# EAGLE design Solenoid Board (EAGLE 9.2.0)
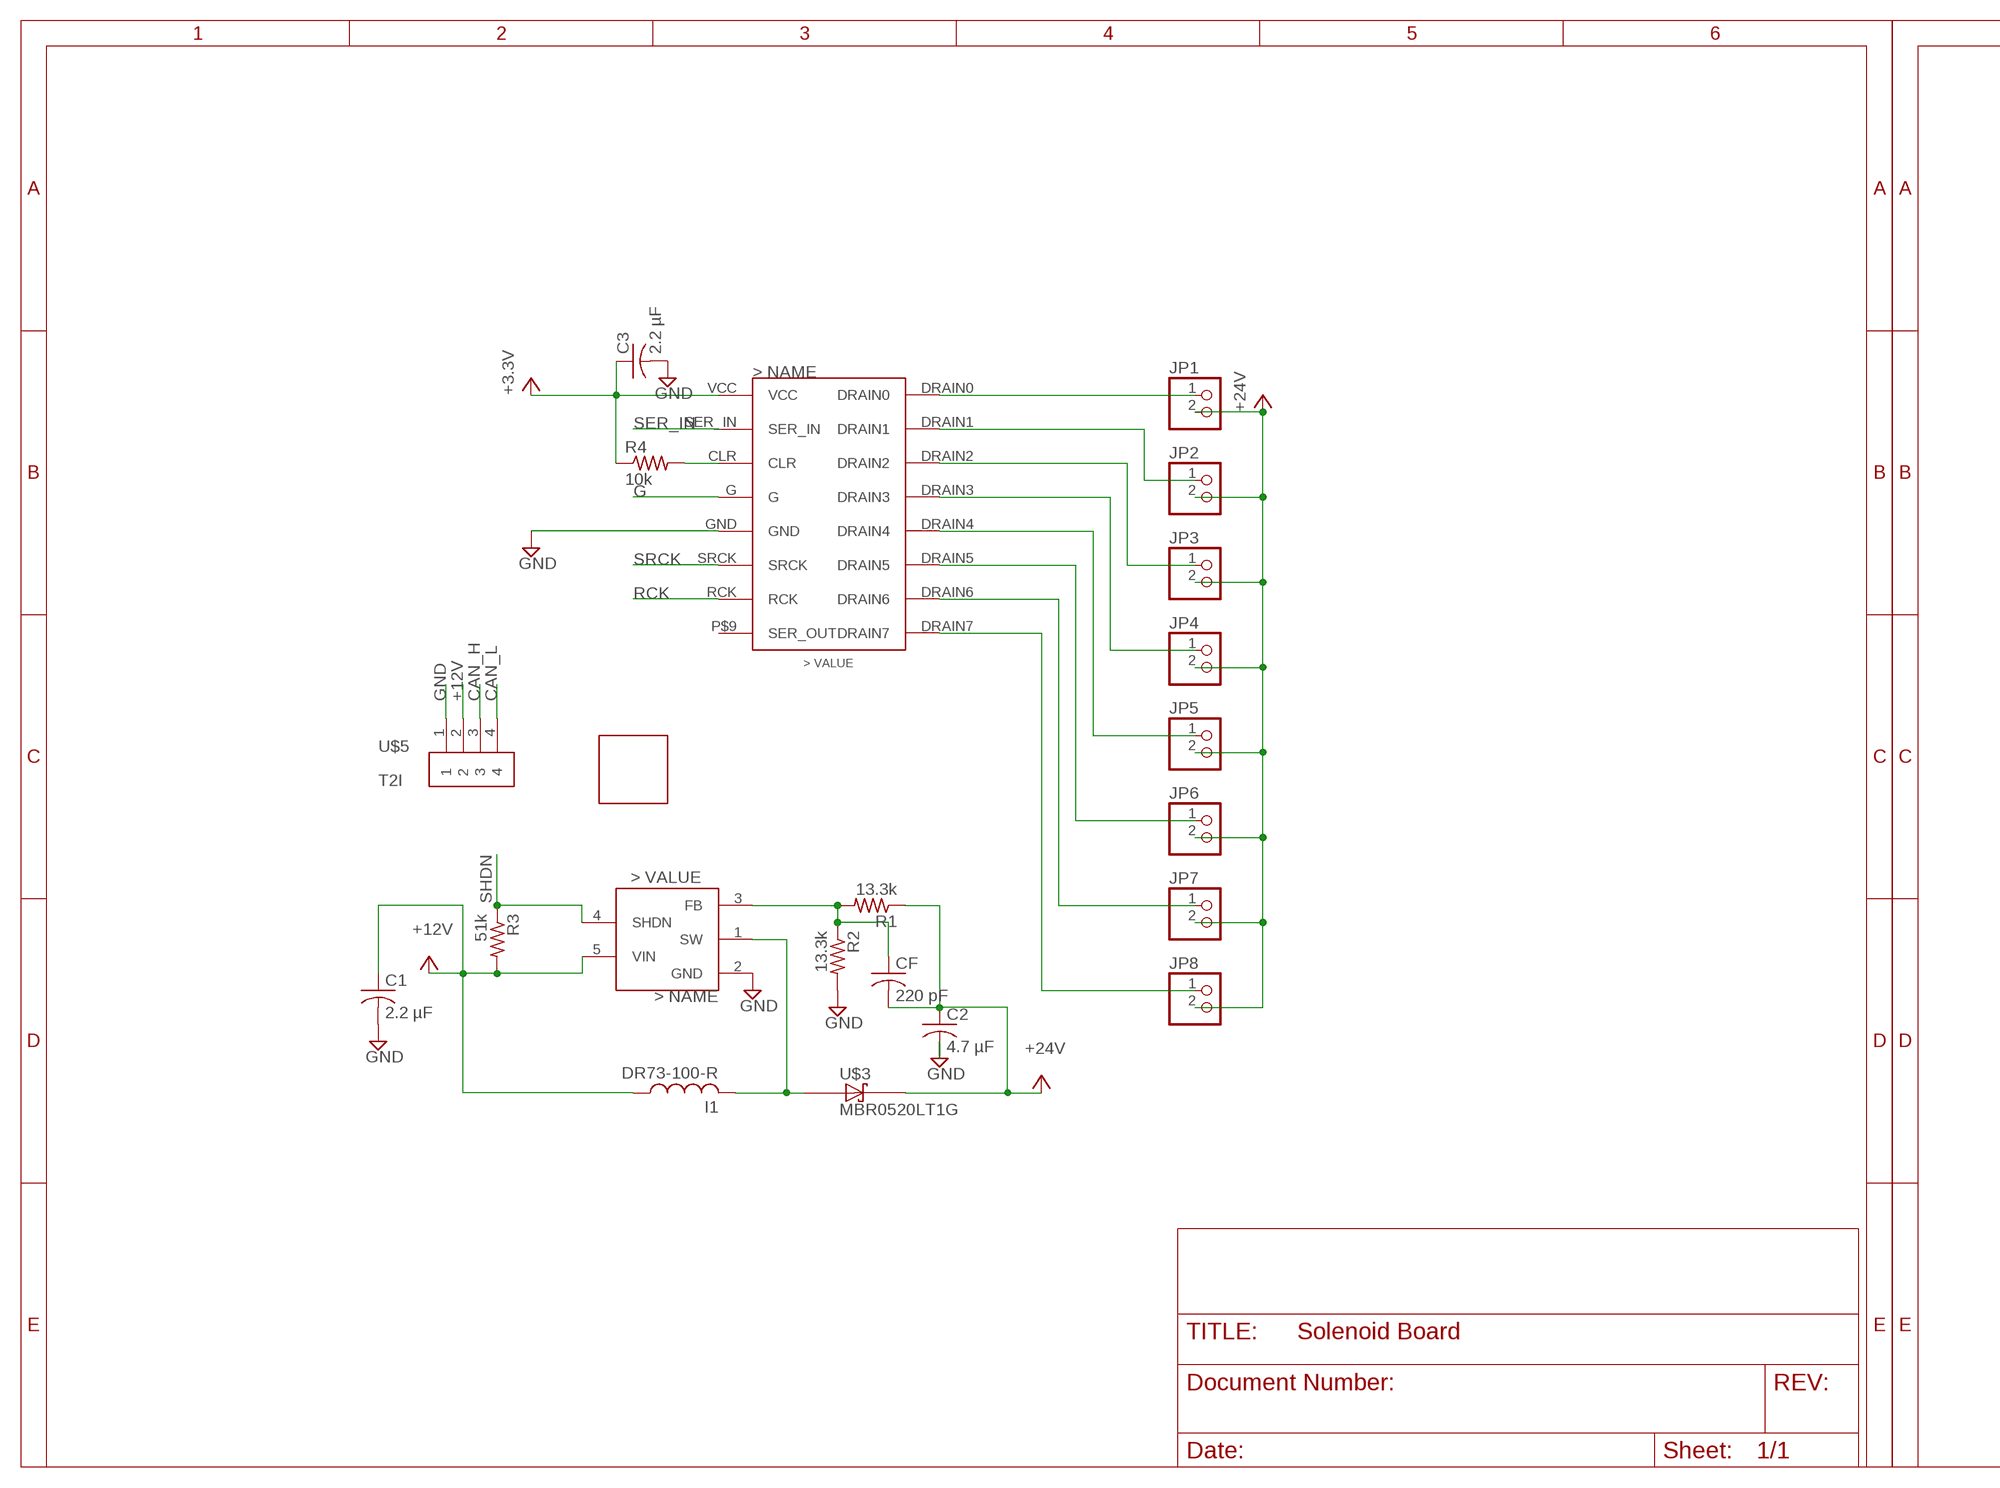
[diagram p0: schematic, sheet 1, part 1 of 2]
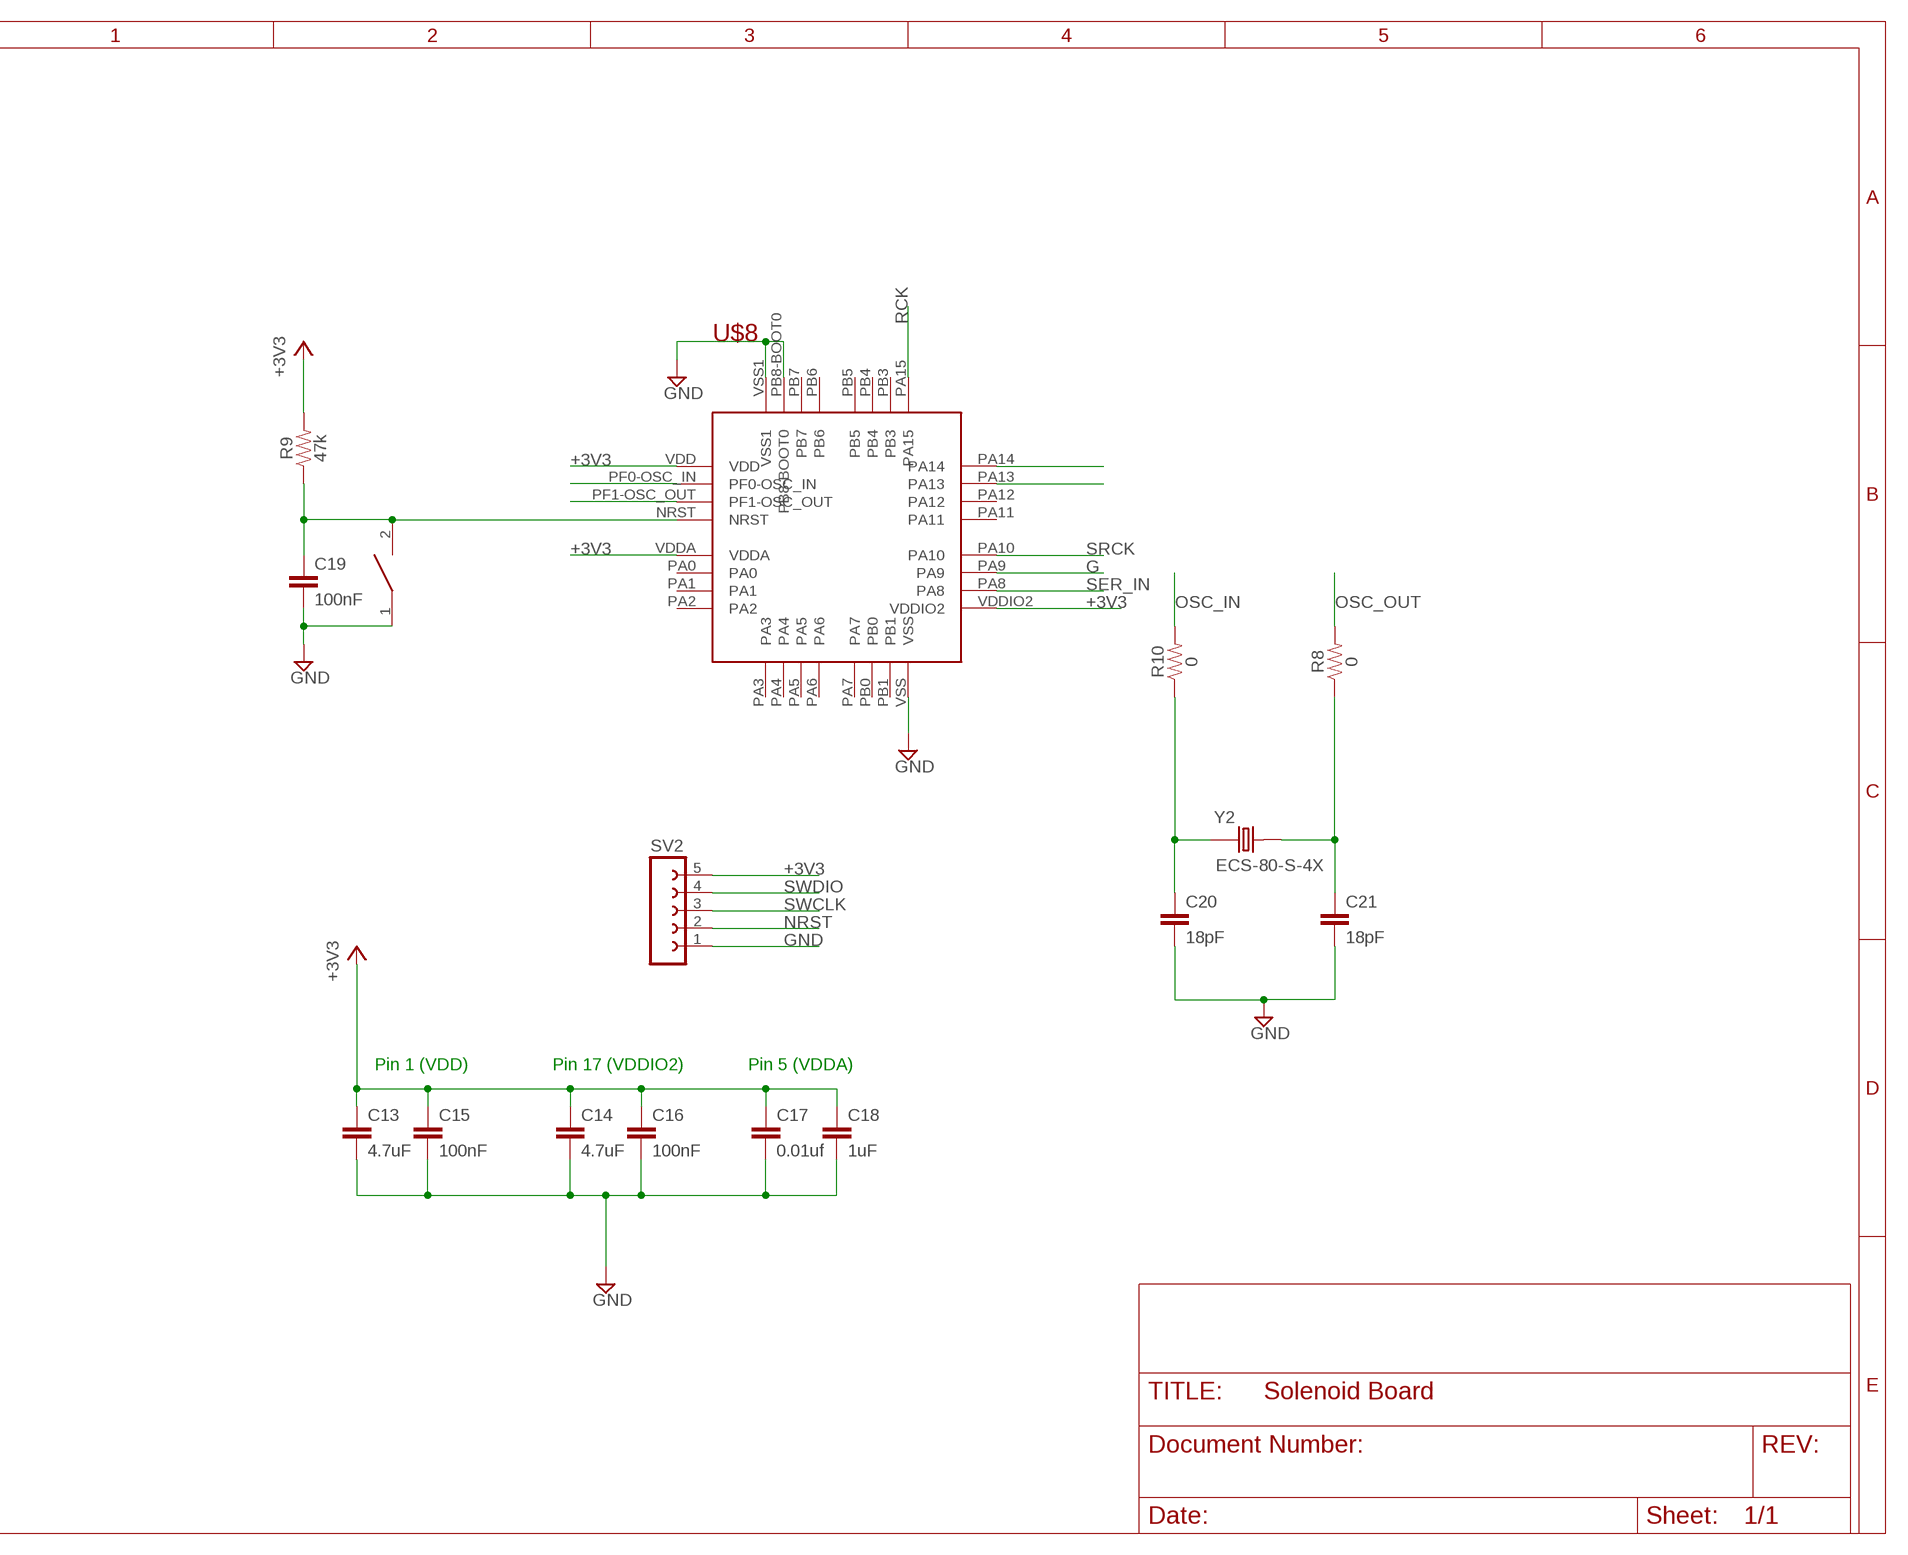
[diagram p1: schematic, sheet 1, part 2 of 2]

## Parts
C1  2.2 µF  C-USC0805  [C0805]
C2  4.7 µF  C-USC0805  [C0805]
C3  2.2 µF  C-USC0805  [C0805]
C13  4.7uF  4.7UF0603  [0603]
C14  4.7uF  4.7UF0603  [0603]
C15  100nF  4.7UF0603  [0603]
C16  100nF  4.7UF0603  [0603]
C17  0.01uf  4.7UF0603  [0603]
C18  1uF  4.7UF0603  [0603]
C19  100nF  4.7UF0603  [0603]
C20  18pF  4.7UF0603  [0603]
C21  18pF  4.7UF0603  [0603]
CF  220 pF  C-USC0805  [C0805]
I1  DR73-100-R  [DR73-100-R]
JP1  PINHD-1X2  [1X02]
JP2  PINHD-1X2  [1X02]
JP3  PINHD-1X2  [1X02]
JP4  PINHD-1X2  [1X02]
JP5  PINHD-1X2  [1X02]
JP6  PINHD-1X2  [1X02]
JP7  PINHD-1X2  [1X02]
JP8  PINHD-1X2  [1X02]
R1  13.3k  R-US_R0603  [R0603]
R2  13.3k  R-US_R0603  [R0603]
R3  51k  R-US_R0603  [R0603]
R4  10k  R-US_R0603  [R0603]
R8  0  1KOHM-0603-1/10W-1%  [0603]
R9  47k  1KOHM-0603-1/10W-1%  [0603]
R10  0  1KOHM-0603-1/10W-1%  [0603]
RESET1  SWITCH  [SW_2512]
SV2  FE05-1  [FE05-1]
U$1  SHIFT_REGISTER  [SHIFT_REGISTER]
U$2  LM27313  [SOT95P300X145-5]
U$3  MBR0520LT1G  [SOD3716X135]
U$5  T2I  [T2I]
U$6  BOARDPNE  [PNE]
U$8  STM32F042K6T6  [STM32F042K6T6]
Y2  ECS-80-S-4X  [XTAL_ECS-80-S-4X]

## Nets
+3.3V: C3.1 R4.1 U$1.VCC
+3V3: C13.1 C14.1 C15.1 C16.1 C17.1 C18.1 R9.2 SV2.5 U$8.VDD U$8.VDDA U$8.VDDIO2
+12V: C1.1 I1.1 R3.2 U$2.5(VIN) U$5.2
+24V: C2.1 CF.2 JP1.2 JP2.2 JP3.2 JP4.2 JP5.2 JP6.2 JP7.2 JP8.2 R1.1 U$3.2(C)
CAN_H: U$5.3
CAN_L: U$5.4
CLR: R4.2 U$1.CLR
DRAIN0: JP1.1 U$1.DRAIN0
DRAIN1: JP2.1 U$1.DRAIN1
DRAIN2: JP3.1 U$1.DRAIN2
DRAIN3: JP4.1 U$1.DRAIN3
DRAIN4: JP5.1 U$1.DRAIN4
DRAIN5: JP6.1 U$1.DRAIN5
DRAIN6: JP7.1 U$1.DRAIN6
DRAIN7: JP8.1 U$1.DRAIN7
FB: CF.1 R1.2 R2.1 U$2.3(FB)
G: U$1.G U$8.PA9
GND: C1.2 C2.2 C3.2 C13.2 C14.2 C15.2 C16.2 C17.2 C18.2 C19.2 C20.2 C21.2 R2.2 RESET1.1 SV2.1 U$1.GND U$2.2(GND) U$5.1 U$8.PB8-BOOT0 U$8.VSS U$8.VSS1
N$15: C21.1 R8.1 Y2.2
N$16: C20.1 R10.1 Y2.1
NRST: C19.1 R9.1 RESET1.2 SV2.2 U$8.NRST
OSC_IN: R10.2 U$8.PF0-OSC_IN
OSC_OUT: R8.2 U$8.PF1-OSC_OUT
RCK: U$1.RCK U$8.PA15
SER_IN: U$1.SER_IN U$8.PA8
SHDN: R3.1 U$2.4(SHDN)
SRCK: U$1.SRCK U$8.PA10
SW: I1.2 U$2.1(SW) U$3.1(A)
SWCLK: SV2.3 U$8.PA14
SWDIO: SV2.4 U$8.PA13
Unconnected: U$1.P$9(SER_OUT) U$8.PA0 U$8.PA1 U$8.PA2 U$8.PA3 U$8.PA4 U$8.PA5 U$8.PA6 U$8.PA7 U$8.PA11 U$8.PA12 U$8.PB0 U$8.PB1 U$8.PB3 U$8.PB4 U$8.PB5 U$8.PB6 U$8.PB7

## Notes on the sheet
- Pin 1 (VDD) | Pin 17 (VDDIO2) | Pin 5 (VDDA)

## Library data of the parts
C1-C3 CF = rcl:C-US: CAPACITOR, American symbol; SPICEPREFIX: C
C13 C14 = SparkFun-Capacitors:4.7UF: 4.7µF ceramic capacitors A capacitor is a passive two-terminal electrical component used to store electrical energy temporarily in an electric field.; PROD_ID: CAP-08280
C15-C21 = SparkFun-Capacitors:4.7UF: 4.7µF ceramic capacitors A capacitor is a passive two-terminal electrical component used to store electrical energy temporarily in an electric field.; PROD_ID: CAP-08280; VALUE: 4.7uF
I1 = Solenoid_parts:DR73-100-R
JP1-JP8 = pinhead:PINHD-1X2: PIN HEADER
R1-R4 = rcl:R-US_: RESISTOR, American symbol; SPICEPREFIX: R
R8-R10 = SparkFun-Resistors:1KOHM: 1kΩ resistor A resistor is a passive two-terminal electrical component that implements electrical resistance as a circuit element. Resistors act to reduce current flow, and, at the same time, act to lower voltage levels within circuits. - Wikipedia; PROD_ID: RES-07856; VALUE: 1k
RESET1 = DiscreteComponents:SWITCH
SV2 = con-lsta:FE05-1: FEMALE HEADER; OC_FARNELL: unknown; OC_NEWARK: unknown
U$1 = Solenoid_parts:SHIFT_REGISTER
U$2 = Solenoid_parts:LM27313
U$3 = Solenoid_parts:MBR0520LT1G: Surface Mount Schottky Power Rectifier Plastic SOD−123 Package
U$5 = BackplaneParts:T2I
U$6 = board_outlines:BOARD
U$8 = PI_Shield_Library:STM32F042K6T6
Y2 = ECS-80-S-4X:ECS-80-S-4X: CRYSTAL T/H; DESCRIPTION: Crystal 8MHz Series 2-Pin HC-49/U; DIGI-KEY_PART_NUMBER: X1057-ND; DIGI-KEY_PURCHASE_URL: https://www.digikey.com/product-detail/en/ecs-inc/ECS-80-S-4X/X1057-ND/827549?utm_source=snapeda&utm_medium=aggregator&utm_campaign=symbol; MF: ECS International; MP: ECS-80-S-4X; PACKAGE: HC-49/US ECS International

## Board
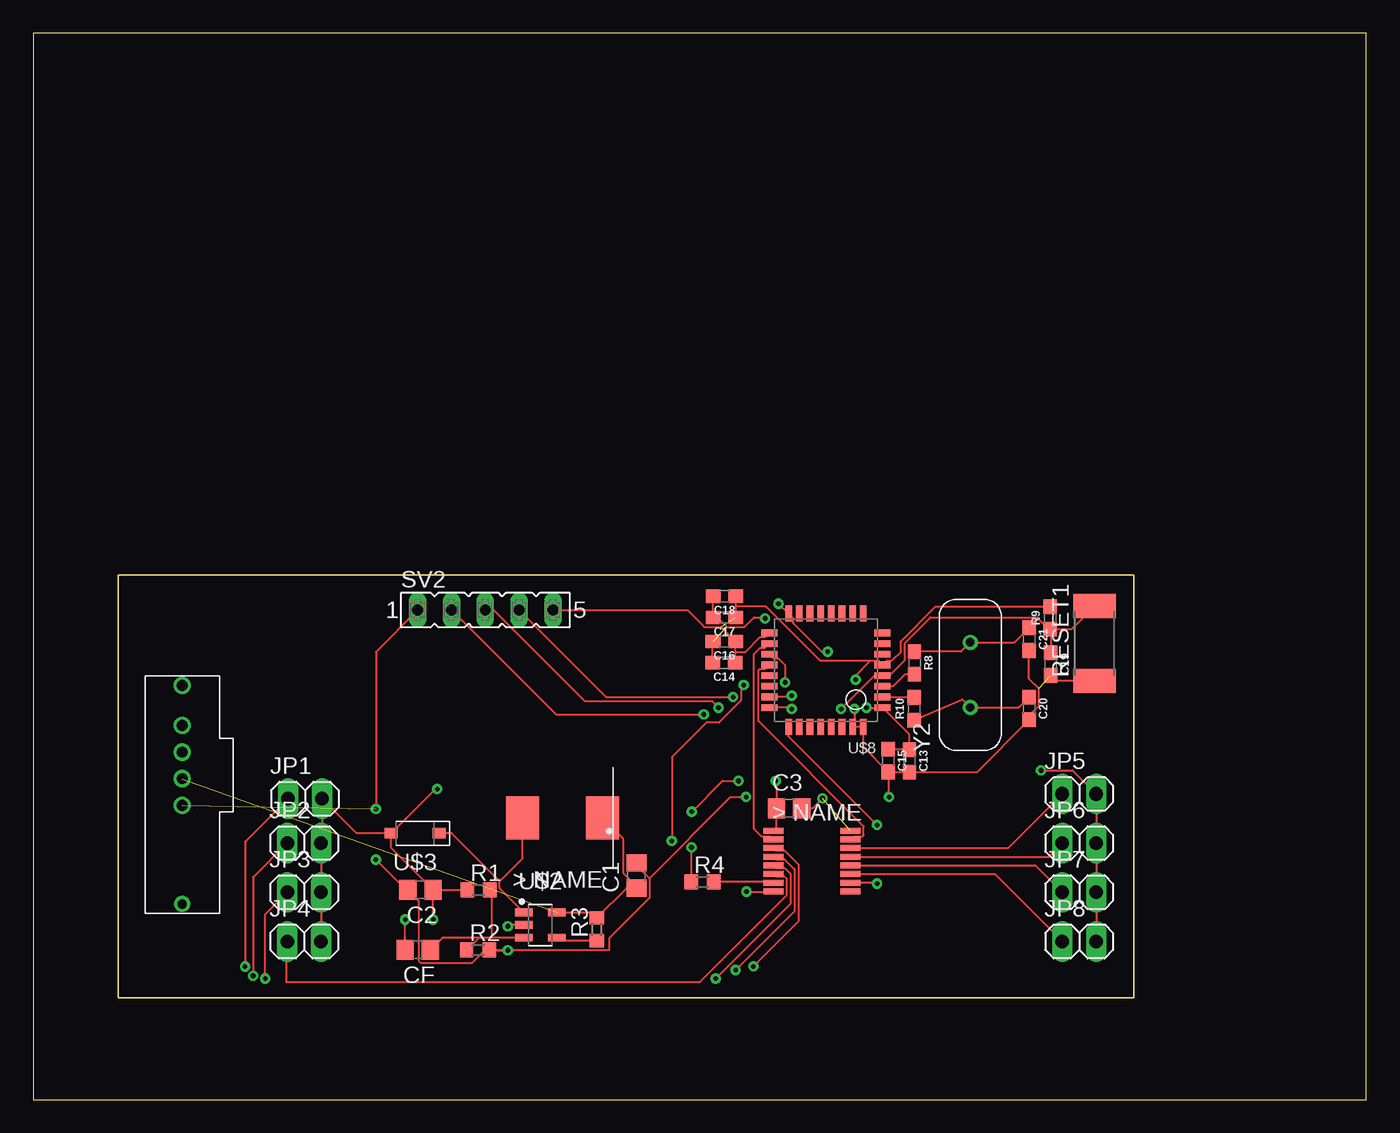
[diagram p2: board, top side]
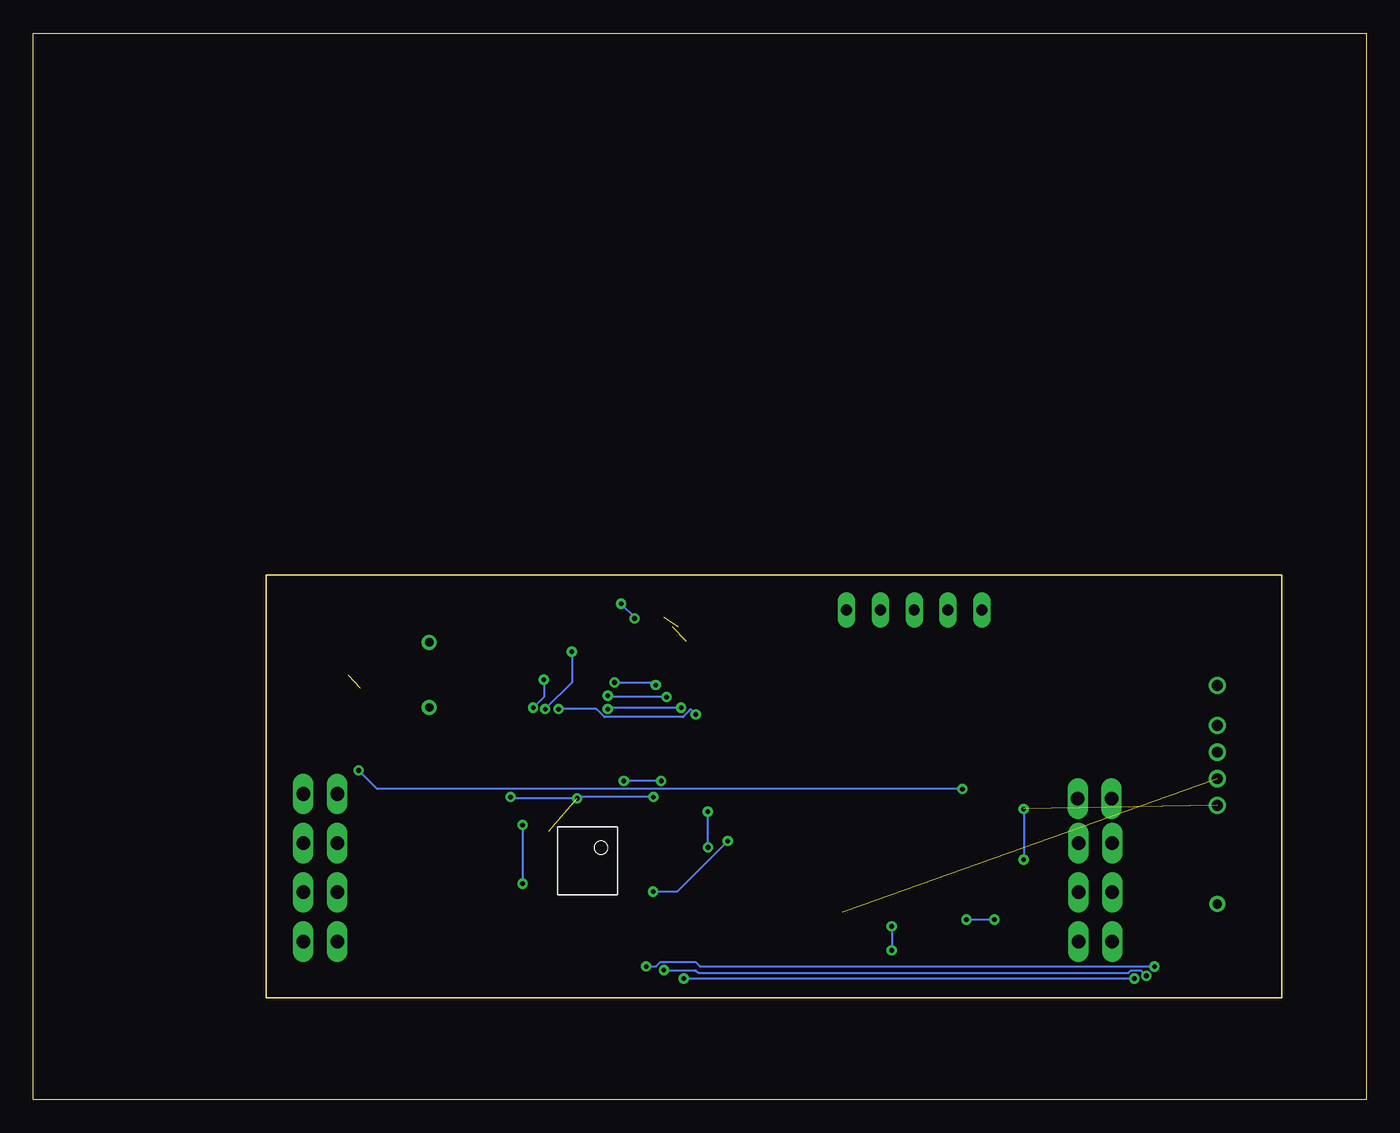
[diagram p3: board, bottom side, seen from below]

Size 100 x 80 mm. Coordinates in mm from the lower left corner, seen from the top.
Outline: 0,0 100,0 100,80 0,80 0,0
Copper layers (1*16): Top 0.035mm / dielectric 1.5mm / Bottom 0.035mm
Design rules "default": minimum track width 6mil, minimum drill 0.35mm, track to track 6mil, track to pad 6mil, pad to pad 6mil, via to via 6mil, smd to smd 6mil, copper to edge 40mil, drill to drill 6mil, minimum pad ring 10mil, minimum via ring 8mil, stop-mask expansion 4mil, vias tented up to drill 0mil, thermal gap 10mil

### Footprints (pad centres in the part's own frame; a part is rotated, then mirrored left to right if it is on the bottom)
C0805 = smd 1.3 x 1.5: 1 -0.95,0; 2 0.95,0
0603 = smd 1.1 x 1: 1 -0.85,0; 2 0.85,0
DR73-100-R = smd 2.5 x 3.25: 1 -3,0; 2 3,0
1X02 = drill 1.016 long: 1 -1.27,0; 2 1.27,0
R0603 = smd 1 x 1.1: 1 -0.85,0; 2 0.85,0
SW_2512 = smd 1.8 x 3.2: 1 -2.8,0; 2 2.8,0
FE05-1 = drill 0.813 long: 1 -5.08,0; 2 -2.54,0; 3 0,0; 4 2.54,0; 5 5.08,0
SHIFT_REGISTER = smd 1.5 x 0.45: CLR -2.9,-1.625; DRAIN0 -2.9,0.975; DRAIN1 -2.9,0.325; DRAIN2 -2.9,-0.325; DRAIN3 -2.9,-0.975; DRAIN4 2.9,0.975; DRAIN5 2.9,0.325; DRAIN6 2.9,-0.325; DRAIN7 2.9,-0.975; G -2.9,-2.275; GND 2.9,2.275; P$9 2.9,-2.275; RCK 2.9,-1.625; SER_IN -2.9,1.625; SRCK 2.9,1.625; VCC -2.9,2.275
SOT95P300X145-5 = smd 1.319 x 0.589: 1 -1.246,0.95; 2 -1.246,0; 3 -1.246,-0.95; 4 1.246,-0.95; 5 1.246,0.95
SOD3716X135 = smd 0.977 x 0.789: 1 -1.796,0; 2 1.796,0
T2I = drill 0.8: 1 8.1,2.8; 2 10.1,2.8; 3 12.1,2.8; 4 14.1,2.8; S2 17.1,2.8 | drill 0.7: S1 0.7,2.8
STM32F042K6T6 = smd 1.2 x 0.5: NRST 0,3.2; PA0 0,1.6; PA1 0,0.8; PA2 0,0; PA8 8.5,0.8; PA9 8.5,1.6; PA10 8.5,2.4; PA11 8.5,3.2; PA12 8.5,4; PA13 8.5,4.8; PA14 8.5,5.6; PF0-OSC_IN 0,4.8; PF1-OSC_OUT 0,4; VDD 0,5.6; VDDA 0,2.4; VDDIO2 8.5,0 | smd 0.5 x 1.2: PA3 1.45,-1.45; PA4 2.25,-1.45; PA5 3.05,-1.45; PA6 3.85,-1.45; PA7 4.65,-1.45; PA15 7.05,7.05; PB0 5.45,-1.45; PB1 6.25,-1.45; PB3 6.25,7.05; PB4 5.45,7.05; PB5 4.65,7.05; PB6 3.85,7.05; PB7 3.05,7.05; PB8-BOOT0 2.25,7.05; VSS 7.05,-1.45; VSS1 1.45,7.05
XTAL_ECS-80-S-4X = drill 0.63 pad 1.03: 1 -2.44,0; 2 2.44,0

### Placement (x,y rotation side)
C1  45.24,16.81 90 top
C2  29.04,15.74 180 top
C3  56.71,21.86 0 top
C13  65.73,25.41 270 top
C14  51.82,32.77 180 top
C15  64.13,25.43 270 top
C16  51.84,34.37 180 top
C17  51.85,36.17 180 top
C18  51.86,37.77 180 top
C19  76.33,32.67 270 top
C20  74.71,29.34 270 top
C21  74.71,34.55 270 top
CF  28.84,11.24 180 top
I1  39.71,21.13 180 top
JP1  20.38,22.57 0 top
JP2  20.32,19.24 0 top
JP3  20.32,15.55 0 top
JP4  20.32,11.86 0 top
JP5  78.47,22.93 0 top
JP6  78.47,19.24 0 top
JP7  78.47,15.55 0 top
JP8  78.47,11.86 0 top
R1  33.41,15.73 0 top
R2  33.36,11.23 0 top
R3  42.27,12.78 90 top
R4  50.2,16.33 0 top
R8  66.11,32.76 270 top
R9  76.29,36.13 90 top
R10  66.09,29.32 90 top
RESET1  79.62,34.22 90 top
SV2  33.91,36.73 0 top
U$1  58.42,17.9 0 top
U$2  38.04,13.1 0 top
U$3  28.64,19.97 180 top
U$5  13.97,13.97 90 top
U$6  6.35,7.62 0 top
U$8  63.72,35.01 180 top
Y2  70.3,31.86 90 top

### Tracks (layer width: path | path; a pad name or v marks a point on that pad's centre or on a via)
+3.3V  (via drill 0.35)
  Top 0.152: U$1.VCC 55.76,20.41 C3.1 55.76,23.85 v55.7,23.91 | R4.1 49.39,16.37 v49.39,18.91 | v49.4,21.6 51.71,23.91 v52.9,23.91
  Bottom 0.152: v49.39,18.91 49.39,21.59 v49.4,21.6 | v52.9,23.91 v55.7,23.91
+3V3  (via drill 0.35)  (1 unrouted)
  Top 0.152: C15.1 64.15,26.26 C13.1 65.73,27.4 U$8.VDD v62.5,29.4 | C14.1 52.67,33.6 | 52.67,33.6 52.67,34.35 | 52.67,34.35 C16.1 | C17.1 52.7,37 | 52.7,37 C18.1 | U$8.VDDIO2 54.9,34.69 54.52,34.69 53.44,33.6 52.67,33.6 | 52.7,37 54.96,37 59.02,32.93 62.8,32.93 | 62.8,32.93 63.4,32.93 U$8.VDDA 64.04,32.93 64.42,32.93 65.08,33.59 65.08,34.38 67.68,36.98 R9.2 | 62.8,32.93 61.7,31.83 v61.7,31.5 | 52.67,34.35 51.58,35.44 50.35,35.44 49.07,36.73 SV2.5
  Bottom 0.152: v61.7,31.5 61.7,30.2 v62.5,29.4
+12V  (1 unrouted)
  Top 0.152: U$2.5 41.85,14.05 R3.2 44.5,15.86 C1.1 45.24,16.04 44.26,17.02 44.26,19.58 I1.1
+24V  (via drill 0.35)
  Top 0.152: U$3.2 30.17,23.3 v30.3,23.3 | v75.6,24.7 77.97,24.7 JP5.2 JP6.2 JP7.2 JP8.2 | U$3.2 24.25,19.97 JP1.2 21.65,19.3 JP2.2 JP3.2 JP4.2 | C2.1 26.84,18.89 U$3.2 | C2.1 R1.1 | CF.2 v27.89,13.49 v27.9,13.5 | v30,13.5 C2.1
  Bottom 0.152: v30.3,23.3 74.2,23.3 v75.6,24.7 | v27.9,13.5 v30,13.5
CLR
  Top 0.152: R4.2 55.47,16.33 U$1.CLR
DRAIN0  (via drill 0.35)
  Top 0.152: U$1.DRAIN0 55.72,18.68 56.37,18.68 57.41,17.63 57.41,13.37 v54.02,9.98 | v15.88,9.98 15.88,19.34 JP1.1
  Bottom 0.152: v54.02,9.98 53.28,9.98 52.94,10.32 50.32,10.32 49.99,9.99 16.29,9.99 16.28,9.98 v15.88,9.98
DRAIN1  (via drill 0.35)
  Top 0.152: U$1.DRAIN1 55.72,18.03 56.37,18.03 57.11,17.29 57.11,14.13 v52.69,9.71 | v16.49,9.28 16.49,16.68 JP2.1
  Bottom 0.152: 52.66,9.68 v52.69,9.71 50.31,9.71 50.1,9.5 17.84,9.5 17.65,9.68 16.9,9.68 v16.49,9.28
DRAIN2  (via drill 0.35)
  Top 0.152: U$1.DRAIN2 55.72,17.38 56.37,17.38 56.8,16.94 56.8,14.68 v51.2,9.08 | v17.4,9.08 17.4,13.9 JP3.1
  Bottom 0.152: v51.2,9.08 v17.4,9.08
DRAIN3
  Top 0.152: JP4.1 19,11.81 19,8.78 49.97,8.78 56.5,15.3 56.5,16.59 56.37,16.73 55.72,16.73 U$1.DRAIN3
DRAIN4
  Top 0.152: U$1.DRAIN4 73.14,18.88 JP5.1
DRAIN5
  Top 0.152: U$1.DRAIN5 76.19,18.23 JP6.1
DRAIN6
  Top 0.152: U$1.DRAIN6 75.17,17.57 JP7.1
DRAIN7
  Top 0.152: U$1.DRAIN7 72.14,16.93 JP8.1
FB
  Top 0.152: U$2.3 34.4,12.15 | 34.4,12.15 33.43,12.15 | 33.43,12.15 R2.1 | 33.43,12.15 30.7,12.15 CF.1 | 34.4,12.15 34.4,15.59 R1.2
G  (via drill 0.35)
  Top 0.152: U$8.PA9 55.54,33.09 55.91,33.09 56.4,32.6 v56.4,31.3 | v47.9,19.4 47.9,25.7 50.49,28.29 51.45,28.29 53.11,29.95 53.11,30.91 v53.3,31.1 | v53.5,15.6 55.49,15.6 U$1.G
  Bottom 0.152: v56.4,31.3 53.5,31.3 v53.3,31.1 | v47.9,19.4 51.7,15.6 v53.5,15.6
GND  (via drill 0.35)  (4 unrouted)
  Top 0.152: U$2.2 35.7,13.1 v35.6,13 | v35.6,11.2 34.24,11.2 R2.2 | 46.22,16.61 46.22,15.12 43.2,12.1 43.2,11.2 v35.6,11.2 | C1.2 45.24,17.58 46.22,16.61 | v35.6,11.2 33.85,11.2 32.91,10.26 29.05,10.26 28.91,10.39 28.91,14.92 C2.2 27.96,15.74 v25.7,18 | C21.2 74.71,31.56 75.44,30.84 75.44,29.55 74.71,28.82 C20.2 70.78,24.56 C13.2 64.15,24.56 | RESET1.1 76.73,31.42 C19.2 | 64.15,24.56 C15.2 | C15.2 | C14.2 50.97,34.35 C16.2 | C17.2 | C17.2 C18.2 | C15.2 62.27,26.44 U$8.VSS1 U$8.PB8-BOOT0 61.59,28.08 v61.59,29.3 | v59.6,33.6 59.16,33.6 56.99,35.77 56.99,36.14 U$8.VSS 56.64,36.46 v55.9,37.2 | v54.9,36.1 54.83,36.17 54.07,36.17 53.34,35.44 52.05,35.44 51.33,36.17 C17.2 | SV2.1 25.7,33.6 v25.7,21.8 | 46.22,16.61 52.31,22.69 v53.48,22.69 | v59.2,22.6 58.46,21.86 C3.2 | v64.2,22.69 64.2,24.51 64.15,24.56
  Bottom 0.152: v35.6,13 v35.6,11.2 | v59.6,33.6 59.6,31.29 v61.59,29.3 | v54.9,36.1 54.9,36.2 v55.9,37.2 | v25.7,21.8 v25.7,18 | v53.48,22.69 59.11,22.69 v59.2,22.6 64.11,22.6 v64.2,22.69
N$15
  Top 0.152: R8.1 69.61,33.61 Y2.2 73.61,34.3 C21.1
N$16
  Top 0.152: R10.1 69.69,30.03 Y2.1 73.94,29.42 C20.1
NRST  (via drill 0.35)
  Top 0.152: R9.1 76.33,35.24 C19.1 | R9.1 77.88,35.28 RESET1.2 | R9.1 76.2,35.28 75.31,36.18 67.31,36.18 65.38,34.26 65.38,32.97 64.23,31.81 U$8.NRST 63.11,31.81 v60.6,29.3 | SV2.2 39.2,28.9 v50.3,28.9
  Bottom 0.152: v50.3,28.9 50.7,29.3 50.79,29.21 50.79,29.15 51.25,28.69 57.15,28.69 57.76,29.3 v60.6,29.3
OSC_IN
  Top 0.152: R10.2 63.76,30.17 U$8.PF0-OSC_IN
OSC_OUT
  Top 0.152: R8.2 65.41,31.91 64.5,31 U$8.PF1-OSC_OUT
RCK  (via drill 0.35)
  Top 0.152: v63.3,16.2 63.23,16.27 U$1.RCK | U$8.PA15 56.67,27.23 v63.3,20.6
  Bottom 0.152: v63.3,20.6 v63.3,16.2
SER_IN
  Top 0.152: 55.45,19.6 U$1.SER_IN 55.32,19.72 54.67,19.72 54.09,20.31 54.09,33.45 54.52,33.89 54.9,33.89 U$8.PA8
SHDN
  Top 0.152: U$2.4 39.51,11.93 R3.1
SRCK
  Top 0.152: U$1.SRCK 61.52,19.72 62.16,19.72 62.3,19.86 62.3,20.5 54.39,28.4 54.39,32.16 54.52,32.29 54.9,32.29 U$8.PA10
SW
  Top 0.152: U$2.1 34.99,15.86 34.99,16.38 | 34.99,16.38 31.39,19.97 U$3.1 | 34.99,16.38 36.71,18.1 I1.2
SWCLK  (via drill 0.35)
  Top 0.152: v51.4,29.4 50.91,29.89 41.37,29.89 34.53,36.73 SV2.3 | v56.9,29.3 56.79,29.41 U$8.PA14
  Bottom 0.152: v51.4,29.4 56.8,29.4 v56.9,29.3
SWDIO  (via drill 0.35)
  Top 0.152: SV2.4 42.98,30.2 v52.5,30.2 | v56.9,30.3 56.81,30.21 U$8.PA13
  Bottom 0.152: v52.5,30.2 56.8,30.2 v56.9,30.3